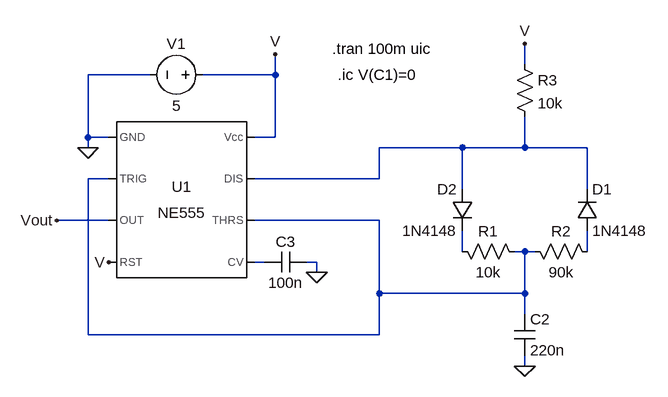
[diagram p0: schematic pulse-width-modulation.asc]
pulse-width-modulation.asc, the LTspice schematic file:
Version 4
SHEET 1 952 680
WIRE 752 -48 752 -80
WIRE 176 -32 80 -32
WIRE 368 -32 368 -64
WIRE 368 -32 256 -32
WIRE 80 64 80 -32
WIRE 112 64 80 64
WIRE 368 64 368 -32
WIRE 368 64 336 64
WIRE 80 80 80 64
WIRE 656 80 528 80
WIRE 752 80 752 32
WIRE 752 80 656 80
WIRE 848 80 752 80
WIRE 112 128 80 128
WIRE 528 128 528 80
WIRE 528 128 336 128
WIRE 656 144 656 80
WIRE 848 144 848 80
WIRE 112 192 32 192
WIRE 528 192 336 192
WIRE 656 240 656 208
WIRE 752 240 736 240
WIRE 768 240 752 240
WIRE 848 240 848 208
WIRE 352 256 336 256
WIRE 432 256 416 256
WIRE 432 272 432 256
WIRE 528 304 528 192
WIRE 752 304 752 240
WIRE 752 304 528 304
WIRE 752 336 752 304
WIRE 80 368 80 128
WIRE 528 368 528 304
WIRE 528 368 80 368
WIRE 752 416 752 400
FLAG 80 80 0
FLAG 32 192 Vout
FLAG 368 -64 V
FLAG 752 -80 V
FLAG 112 256 V
FLAG 752 416 0
FLAG 432 272 0
SYMBOL Misc\\NE555 224 160 R0
SYMATTR InstName U1
SYMBOL voltage 272 -32 R90
WINDOW 0 -32 56 VBottom 2
WINDOW 3 32 56 VTop 2
WINDOW 123 0 0 Left 0
WINDOW 39 0 0 Left 0
SYMATTR InstName V1
SYMATTR Value 5
SYMBOL diode 832 208 M180
WINDOW 0 24 64 Left 2
WINDOW 3 24 0 Left 2
SYMATTR InstName D1
SYMATTR Value 1N4148
SYMBOL diode 672 144 M0
SYMATTR InstName D2
SYMATTR Value 1N4148
SYMBOL res 752 256 M270
WINDOW 0 32 56 VTop 2
WINDOW 3 0 56 VBottom 2
SYMATTR InstName R1
SYMATTR Value 10k
SYMBOL res 864 256 M270
WINDOW 0 32 56 VTop 2
WINDOW 3 0 56 VBottom 2
SYMATTR InstName R2
SYMATTR Value 90k
SYMBOL res 736 -64 R0
SYMATTR InstName R3
SYMATTR Value 10k
SYMBOL cap 736 336 R0
SYMATTR InstName C2
SYMATTR Value 220n
SYMBOL cap 416 240 R90
WINDOW 0 0 32 VBottom 2
WINDOW 3 32 32 VTop 2
SYMATTR InstName C3
SYMATTR Value 100n
TEXT 456 -72 Left 2 !.tran 100m uic
TEXT 464 -32 Left 2 !.ic V(C1)=0

The netlist it stands for:
* pulse-width-modulation.asc
XU1 0 N002 Vout V N005 N002 N001 V NE555  ; pins GND TRIG OUT RST CV THRS DIS Vcc
V1 V 0 5
D1 N004 N001 1N4148
D2 N001 N003 1N4148
R1 N002 N003 10k
R2 N004 N002 90k
R3 V N001 10k
C2 N002 0 220n
C3 0 N005 100n
.model D D
.lib standard.dio
.tran 100m uic
.ic V(C1)=0
.lib NE555.sub
.backanno
.end